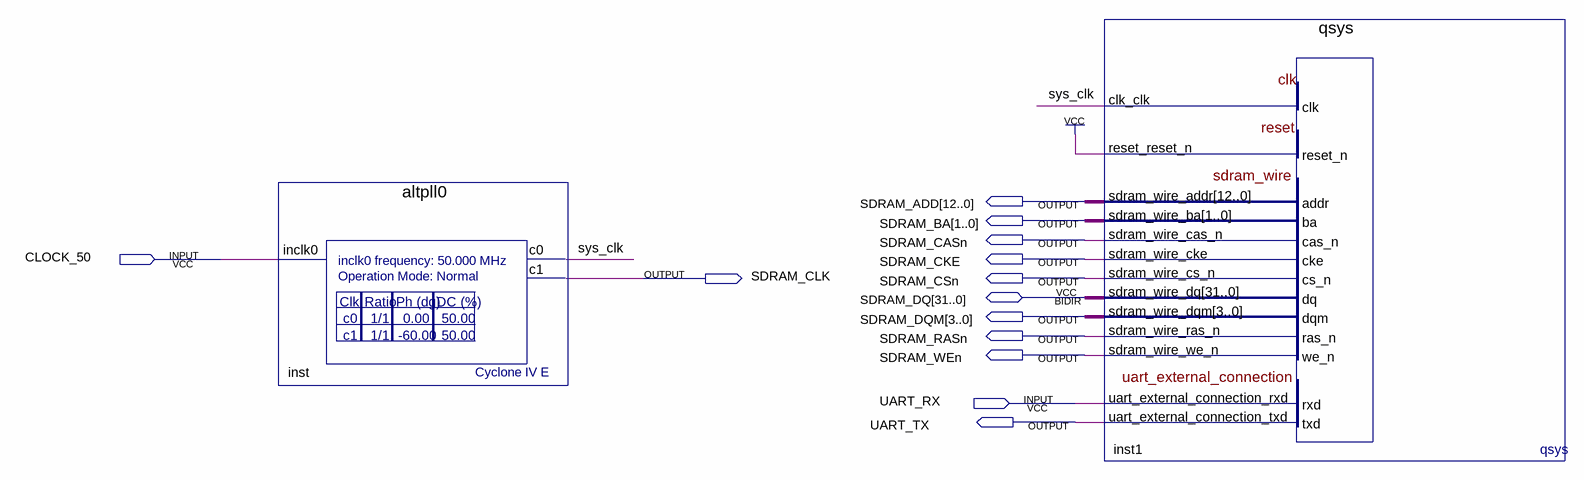
[diagram p0: schematic sheet]
// Quartus schematic DE2_115_uClinux.bdf as structural Verilog: 2 symbols, 13 pins
module DE2_115_uClinux (
  input  CLOCK_50,
  input  UART_RX,
  inout  [31:0] SDRAM_DQ,
  output [12:0] SDRAM_ADD,
  output [1:0] SDRAM_BA,
  output SDRAM_CASn,
  output SDRAM_CKE,
  output SDRAM_CLK,
  output SDRAM_CSn,
  output [3:0] SDRAM_DQM,
  output SDRAM_RASn,
  output SDRAM_WEn,
  output UART_TX
);

  wire sys_clk;

  altpll0 inst (.inclk0(CLOCK_50), .c0(sys_clk), .c1(SDRAM_CLK));
  qsys inst1 (
    .clk_clk(sys_clk), .reset_reset_n(1'b1), .uart_external_connection_rxd(UART_RX),
    .sdram_wire_addr(SDRAM_ADD), .sdram_wire_ba(SDRAM_BA), .sdram_wire_cas_n(SDRAM_CASn),
    .sdram_wire_cke(SDRAM_CKE), .sdram_wire_cs_n(SDRAM_CSn), .sdram_wire_dqm(SDRAM_DQM),
    .sdram_wire_ras_n(SDRAM_RASn), .sdram_wire_we_n(SDRAM_WEn), .uart_external_connection_txd(UART_TX),
    .sdram_wire_dq(SDRAM_DQ));
endmodule
